# Altium schematic sheet Main.SchDoc
size A4; SheetNumber: 1; SheetTotal: 7
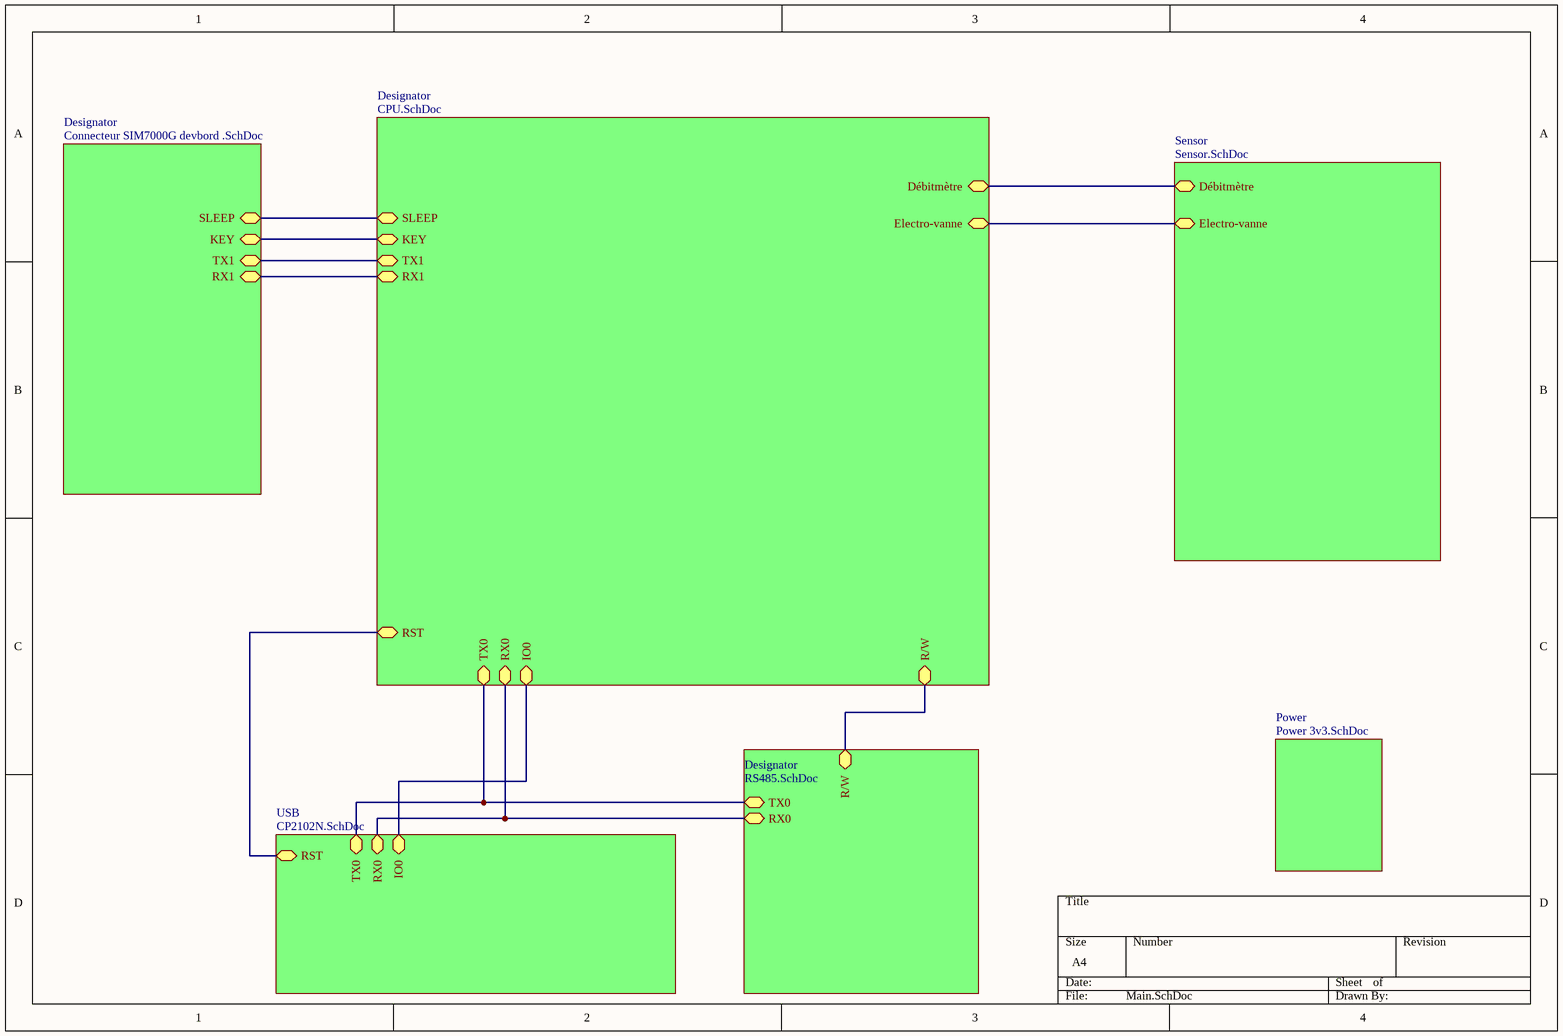
[diagram p0: Main.SchDoc]

## Sub-sheets
Designator = CPU.SchDoc: IO0 (bidir), KEY (bidir), Débitmètre (bidir), Electro-vanne (bidir), R/W (bidir), SLEEP (bidir), RX1 (bidir), TX1 (bidir), TX0 (bidir), RX0 (bidir), RST (bidir)
Designator = Connecteur SIM7000G devbord .SchDoc: RX1 (bidir), TX1 (bidir), KEY (bidir), SLEEP (bidir)
Designator = RS485.SchDoc: RX0 (bidir), TX0 (bidir), R/W (bidir)
Power = Power 3v3.SchDoc: no entries
Sensor = Sensor.SchDoc: Débitmètre (bidir), Electro-vanne (bidir)
USB = CP2102N.SchDoc: TX0 (bidir), RX0 (bidir), IO0 (bidir), RST (bidir)

## Nets
(unnamed): sheet Designator/IO0, sheet USB/IO0
(unnamed): sheet Designator/KEY, sheet Designator/KEY
(unnamed): sheet Designator/Débitmètre, sheet Sensor/Débitmètre
(unnamed): sheet Designator/Electro-vanne, sheet Sensor/Electro-vanne
(unnamed): sheet Designator/R/W, sheet Designator/R/W
(unnamed): sheet Designator/SLEEP, sheet Designator/SLEEP
(unnamed): sheet Designator/RX1, sheet Designator/RX1
(unnamed): sheet Designator/TX1, sheet Designator/TX1
(unnamed): sheet Designator/TX0, sheet USB/TX0, sheet Designator/TX0
(unnamed): sheet Designator/RX0, sheet USB/RX0, sheet Designator/RX0
(unnamed): sheet Designator/RST, sheet USB/RST